# Altium schematic sheet Power_Stage.SchDoc: title
size A3; Author: M.Beldyga; CompanyName: WUT ISE; DrawnBy: M.Beldyga; Organization: WUT ISE; Address1: PW ISE; Address2: Nowowiejska 15/19 00-665 Warsaw; Address3: micbeldyga@gmail.com; SheetNumber: 2; SheetTotal: 3; ModifiedBy: -; CheckedDate: -; Title2: xxx; DivGrp: WUT ISE; Designer: M.Beldyga; ModifiedDate: -; ProjectName: Sensor Box
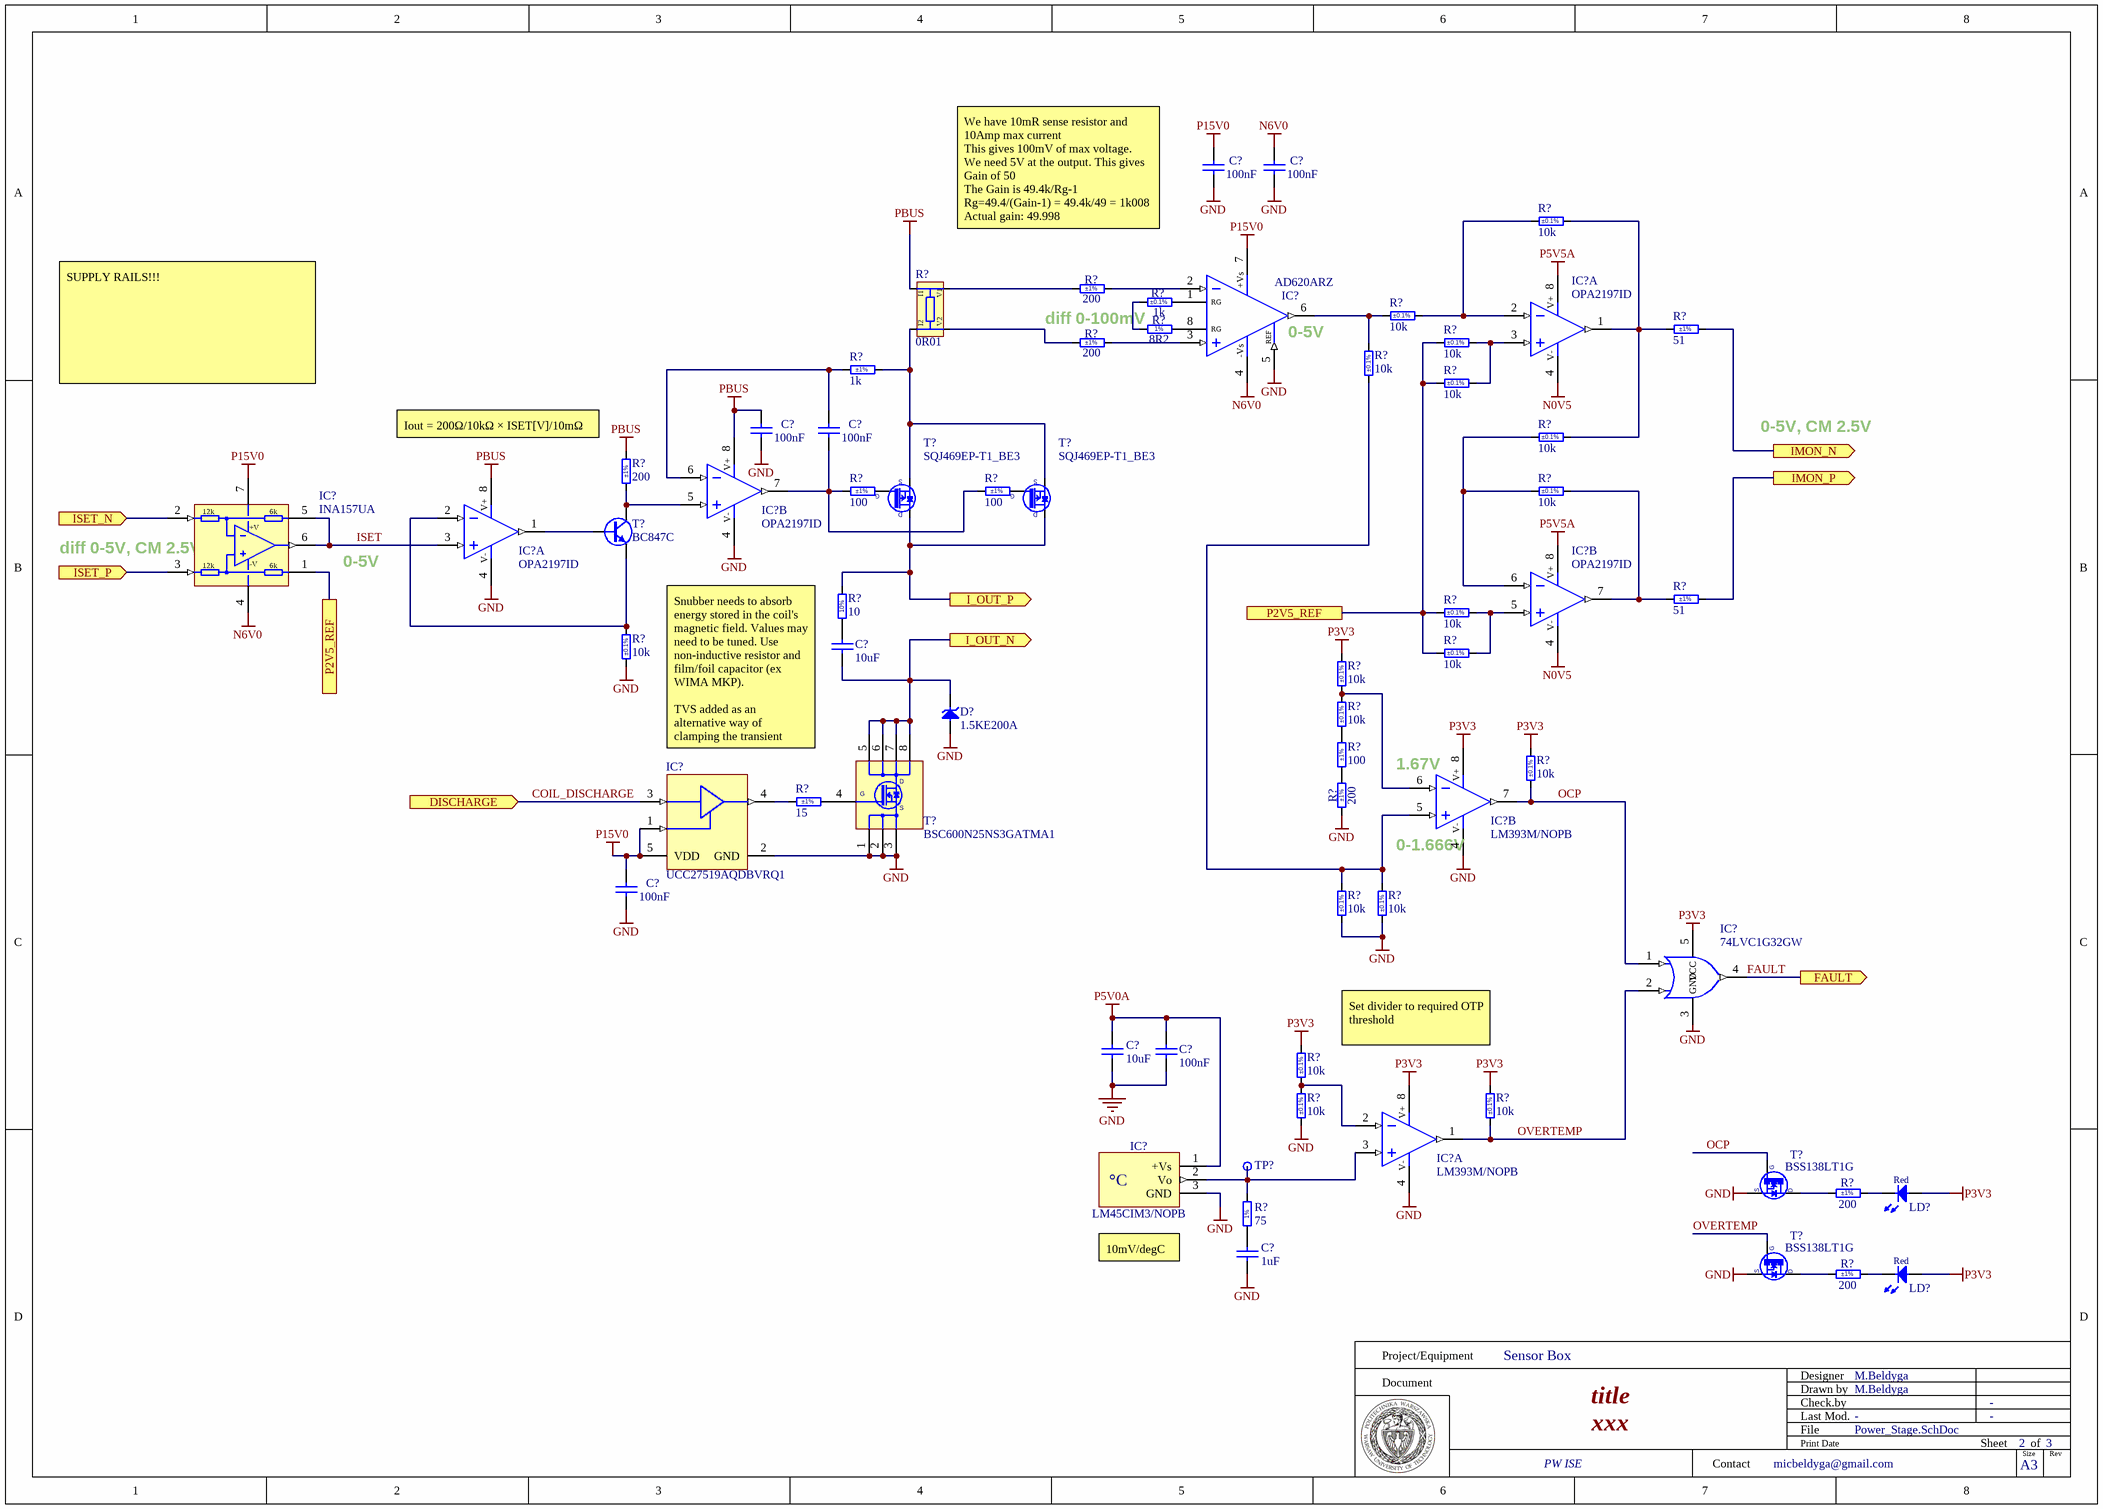
[diagram p0: Power_Stage.SchDoc]

## Parts
(Parts that share a designator on the sheet are numbered #1, #2 ... from top to bottom, then left to right.)
C?#1  100nF  [CAPC1005X55N]
C?#2  100nF  [CAPC1005X55N]
C?#3  100nF  [CAPC1005X55N]
C?#4  100nF  [CAPC1005X55N]
C?#5  10uF  [CAPR3750-2400X4200X1800]
C?#6  100nF  [CAPC1005X55N]
C?#7  10uF  [CAPC1608X80N]
C?#8  100nF  [CAPC1005X55N]
C?#9  1uF  [CAPC1005X55N]
D?  1.5KE200A  [DO-201]
IC?#1  AD620ARZ  [SOIC127P600X175-8N]
IC?#2  OPA2197ID  [SOIC127P600X175-8N]  (part A of 2)
IC?#3  OPA2197ID  [SOIC127P600X175-8N]  (part B of 2)
IC?#4  INA157UA  [SOIC127P600X175-8N]
IC?#5  OPA2197ID  [SOIC127P600X175-8N]  (part A of 2)
IC?#6  OPA2197ID  [SOIC127P600X175-8N]  (part B of 2)
IC?#7  UCC27519AQDBVRQ1  [SOT95P280X145-5N]
IC?#8  LM393M/NOPB  [SOIC127P600X175-8N]  (part B of 2)
IC?#9  74LVC1G32GW  [SOT65P212X110-5N]
IC?#10  LM393M/NOPB  [SOIC127P600X175-8N]  (part A of 2)
IC?#11  LM45CIM3/NOPB  [SOT95P251X112-3N]
LD?#1  Red  [LED_DIALIGHT_555-200]
LD?#2  Red  [LED_DIALIGHT_555-200]
R?#1  10k  Tolerance: ±0.1%  [RESC1005X35N]
R?#2  0R01  [RES_OHMITE_LVK25]
R?#3  200  Tolerance: ±1%  [RESC1608X55N]
R?#4  1k  Tolerance: ±0.1%  [RESC1608X55N]
R?#5  10k  Tolerance: ±0.1%  [RESC1005X35N]
R?#6  8R2  [RESC1608X55N]
R?#7  51  Tolerance: ±1%  [RESC1608X55N]
R?#8  200  Tolerance: ±1%  [RESC1608X55N]
R?#9  10k  Tolerance: ±0.1%  [RESC1005X35N]
R?#10  1k  Tolerance: ±1%  [RESC1005X40N]
R?#11  10k  Tolerance: ±0.1%  [RESC1005X35N]
R?#12  10k  Tolerance: ±0.1%  [RESC1005X35N]
R?#13  10k  Tolerance: ±0.1%  [RESC1005X35N]
R?#14  200  Tolerance: ±1%  [RESC1608X55N]
R?#15  100  Tolerance: ±1%  [RESC1005X40N]
R?#16  100  Tolerance: ±1%  [RESC1005X40N]
R?#17  10k  Tolerance: ±0.1%  [RESC1005X35N]
R?#18  51  Tolerance: ±1%  [RESC1608X55N]
R?#19  10k  Tolerance: ±0.1%  [RESC1005X35N]
R?#20  10k  Tolerance: ±0.1%  [RESC1005X35N]
R?#21  10  [RES_OHMITE_OY]
R?#22  10k  Tolerance: ±0.1%  [RESC1005X35N]
R?#23  10k  Tolerance: ±0.1%  [RESC1005X35N]
R?#24  10k  Tolerance: ±0.1%  [RESC1005X35N]
R?#25  100  Tolerance: ±1%  [RESC1005X40N]
R?#26  10k  Tolerance: ±0.1%  [RESC1005X35N]
R?#27  15  Tolerance: ±1%  [RESC3216X65N]
R?#28  200  Tolerance: ±1%  [RESC1608X55N]
R?#29  10k  Tolerance: ±0.1%  [RESC1005X35N]
R?#30  10k  Tolerance: ±0.1%  [RESC1005X35N]
R?#31  10k  Tolerance: ±0.1%  [RESC1005X35N]
R?#32  10k  Tolerance: ±0.1%  [RESC1005X35N]
R?#33  10k  Tolerance: ±0.1%  [RESC1005X35N]
R?#34  200  Tolerance: ±1%  [RESC1608X55N]
R?#35  75  [RESC1005X40N]
R?#36  200  Tolerance: ±1%  [RESC1608X55N]
T?#1  SQJ469EP-T1_BE3  [PowerPAK® SO-8L SINGLE]
T?#2  SQJ469EP-T1_BE3  [PowerPAK® SO-8L SINGLE]
T?#3  BC847C  [SOT95P240X110-3N]
T?#4  BSC600N25NS3GATMA1  [INFINEON_PG-TDSON-8]
T?#5  BSS138LT1G  [SOT95P240X110-3N]
T?#6  BSS138LT1G  [SOT95P240X110-3N]
TP?  Test Point  [TPS127]  (value not drawn)  (no BOM)

## Ports
DISCHARGE (in), FAULT (out), I_OUT_N (out), I_OUT_P (out), IMON_N (out), IMON_P (out), ISET_N (in), ISET_P (in), P2V5_REF

## Nets
GND: C?#1.1 C?#2.1 C?#3.1 C?#6.1 C?#7.1 C?#8.1 C?#9.1 D?.2(A) IC?#1.5(REF) IC?#3.4(V-) IC?#5.4(V-) IC?#7.2(GND) IC?#8.4(V-) IC?#10.4(V-) IC?#11.3(GND) R?#20.2 R?#28.1 R?#29.1 R?#30.1 R?#32.1 T?#4.1(S) T?#4.2(S) T?#4.3(S) T?#5.2(S) T?#6.2(S)
N0V5: IC?#2.4(V-) IC?#6.4(V-)
N6V0: C?#2.2 IC?#1.4(-Vs) IC?#4.4(-VEE)
P3V3: IC?#8.8(V+) IC?#10.8(V+) LD?#1.2(A) LD?#2.2(A) R?#23.2 R?#26.2 R?#31.2 R?#33.2
P5V0A: C?#7.2 C?#8.2 IC?#11.1(+Vs)
P5V5A: IC?#2.8(V+) IC?#6.8(V+)
P15V0: C?#1.2 C?#6.2 IC?#1.7(+Vs) IC?#4.7(+VCC) IC?#7.1(ENA) IC?#7.5(VDD)
PBUS: C?#3.2 IC?#3.8(V+) IC?#5.8(V+) R?#2.I1 R?#14.2
COIL_DISCHARGE: IC?#7.3(IN+/IN-) ; port DISCHARGE
FAULT: IC?#9.4(Y) ; port FAULT
I_OUT_N: C?#5.1 D?.1(C) T?#4.D ; port I_OUT_N
I_OUT_P: R?#21.2 T?#1.3(D) T?#2.3(D) ; port I_OUT_P
IMON_N: R?#7.2 ; port IMON_N
IMON_P: R?#18.2 ; port IMON_P
ISET: IC?#4.5(SENS) IC?#4.6(OUT) IC?#5.3(IN+)
ISET_N: IC?#4.2(IN-) ; port ISET_N
ISET_P: IC?#4.3(IN+) ; port ISET_P
OCP: IC?#8.7(OUT) IC?#9.1(A) R?#26.1 T?#5.1(G)
OVERTEMP: IC?#9.2(B) IC?#10.1(OUT) R?#33.1 T?#6.1(G)
P2V5_REF: IC?#4.1(REF) R?#9.1 R?#12.1 R?#19.1 R?#22.1 ; port P2V5_REF
NetC?#4_1: C?#4.1 IC?#3.7(OUT) R?#15.1 R?#16.1
NetC?#4_2: C?#4.2 IC?#3.6(IN-) R?#10.1
NetC?#5_2: C?#5.2 R?#21.1
NetC?#9_2: C?#9.2 R?#35.1
NetIC?#1_1: IC?#1.1(-RG) R?#4.2
NetIC?#1_2: IC?#1.2(-IN) R?#3.2
NetIC?#1_3: IC?#1.3(+IN) R?#8.2
NetIC?#1_6: IC?#1.6(Vout) R?#5.1 R?#11.2
NetIC?#1_8: IC?#1.8(+RG) R?#6.2
NetIC?#2_1: IC?#2.1(OUT) R?#1.1 R?#7.1 R?#13.2
NetIC?#2_2: IC?#2.2(IN-) R?#1.2 R?#5.2
NetIC?#2_3: IC?#2.3(IN+) R?#9.2 R?#12.2
NetIC?#3_5: IC?#3.5(IN+) R?#14.1 T?#3.3(C)
NetIC?#5_1: IC?#5.1(OUT) T?#3.1(B)
NetIC?#5_2: IC?#5.2(IN-) R?#20.1 T?#3.2(E)
NetIC?#6_5: IC?#6.5(IN+) R?#19.2 R?#22.2
NetIC?#6_6: IC?#6.6(IN-) R?#13.1 R?#17.2
NetIC?#6_7: IC?#6.7(OUT) R?#17.1 R?#18.1
NetIC?#7_4: IC?#7.4(OUT) R?#27.1
NetIC?#8_5: IC?#8.5(IN+) R?#11.1 R?#29.2 R?#30.2
NetIC?#8_6: IC?#8.6(IN-) R?#23.1 R?#24.2
NetIC?#10_2: IC?#10.2(IN-) R?#31.1 R?#32.2
NetIC?#10_3: IC?#10.3(IN+) IC?#11.2(Vo) R?#35.2 TP?.1
NetLD?#1_1: LD?#1.1(C) R?#34.2
NetLD?#2_1: LD?#2.1(C) R?#36.2
NetR?#2_I2: R?#2.I2 R?#10.2 T?#1.2(S) T?#2.2(S)
NetR?#2_V1: R?#2.V1 R?#3.1
NetR?#2_V2: R?#2.V2 R?#8.1
NetR?#4_1: R?#4.1 R?#6.1
NetR?#15_2: R?#15.2 T?#1.1(G)
NetR?#16_2: R?#16.2 T?#2.1(G)
NetR?#24_1: R?#24.1 R?#25.2
NetR?#25_1: R?#25.1 R?#28.2
NetR?#27_2: R?#27.2 T?#4.4(G)
NetR?#34_1: R?#34.1 T?#5.3(D)
NetR?#36_1: R?#36.1 T?#6.3(D)

Not connected (* = marked no-connect by the designer): IC?#9 3(GND) 5(VCC)

## Notes on the sheet
- We have 10mR sense resistor and 10Amp max current
  This gives 100mV of max voltage.
  We need 5V at the output. This gives Gain of 50
  The Gain is 49.4k/Rg-1
  Rg=49.4/(Gain-1) = 49.4k/49 = 1k008
  Actual gain: 49.998
- SUPPLY RAILS!!!
- (near R?#6) diff 0-100mV
- (near IC?#1) 0-5V
- (near R?#14) Iout = 200Ω/10kΩ × ISET[V]/10mΩ
- 0-5V, CM 2.5V
- (near IC?#4) diff 0-5V, CM 2.5V
- 0-5V
- Snubber needs to absorb energy stored in the coil's magnetic field. Values may need to be tuned. Use non-inductive resistor and film/foil capacitor (ex WIMA MKP).
  TVS added as an alternative way of clamping the transient
- (near IC?#8) 1.67V
- (near IC?#8) 0-1.666V
- (near R?#31) Set divider to required OTP threshold
- (near IC?#11) 10mV/degC
- Labels drawn without touching a wire or pin: GND, P3V3
- Project/Equipment
- Document
- Designer
- Drawn by
- Check.by
- Contact
- File
- Last Mod.
- Print Date
- Sheet
- Size
- A3
- of
- Rev
- (in symbol AD620ARZ) RG
- (in symbol BSC600N25NS3GATMA1) 5; 6; 7
- (in symbol INA157UA) 12k; 6k; +V; -V
- (in symbol LM45CIM3/NOPB) °C
- (in symbol R0402_75R_1%_0.0625W_100PPM) 1%
- (in symbol R0603_8R2_1%_0.1W_200PPM) 1%
- (in symbol RCF_10R_10%_2W_-1300±300PPM_OHMITE_OY) 10%

## Library data of the parts
C?#1-C?#4 C?#6 = CC0402_100NF_16V_10%_X5R: Non-polarised capacitor; Part Description: SMD Multilayer Chip Ceramic Capacitor; Manufacturer: GENERIC; Manufacturer1 Part Number: GRM155R61C104KA88D; Voltage: 16V; TC: X5R; Tolerance: ±10%; Part Number: CC0402_100NF_16V_10%_X5R; Component Kind: Standard; Component Type: Standard; Pin Count: 2; Value: 100nF; Status: None; Manufacturer Part Number: CC0402_100NF_16V_10%_X5R; Case: 0402; Mounted: Yes; Socket: No; SMD: Yes; Sense: No; Manufacturer1 Example: MURATA; Manufacturer1 ComponentHeight: 0.55mm; HelpURL: \\cern.ch\dfs\Applications\Altium\Datasheets\CC0402_X5R_MURATA_GRM.pdf; Author: CERN DEM JLC; CreateDate: 10.12.2013; LatestRevisionDate: 10.12.2013
C?#5 = CPPR_10UF_500V_5%_VISHAY_MKP1848S61050JP2C: Non-polarised capacitor; Part Description: Metallized Polypropylene Film Capacitor (MKP1848S DC-Link); Manufacturer: VISHAY ROEDERSTEIN; Voltage: 500VDC; Tolerance: ±5%; Part Number: CPPR_10UF_500V_5%_VISHAY_MKP1848S61050JP2C; Component Kind: Standard; Component Type: Standard; Pin Count: 2; Value: 10uF; Status: None; Manufacturer Part Number: MKP1848S61050JP2C; Case: LS37.5 W24 x L42 x H18; Mounted: Yes; Socket: No; SMD: No; Sense: No; ComponentHeight: 18mm; HelpURL: \\cern.ch\dfs\Applications\Altium\Datasheets\CPPR_VISHAY_MKP1848S DC-Link.pdf; Author: CERN DEM JLC; CreateDate: 10/23/2013; LatestRevisionDate: 10/23/2013
C?#7 = CC0603_10UF_10V_10%_X5R: Non-polarised capacitor; Part Description: SMD Multilayer Chip Ceramic Capacitor; Manufacturer: GENERIC; Manufacturer1 Part Number: GRM188R61A106KE69D; Voltage: 10V; TC: X5R; Tolerance: ±10%; Part Number: CC0603_10UF_10V_10%_X5R; Component Kind: Standard; Component Type: Standard; Pin Count: 2; Value: 10uF; Status: None; Manufacturer Part Number: CC0603_10UF_10V_10%_X5R; Case: 0603; Mounted: Yes; Socket: No; SMD: Yes; Sense: No; Manufacturer1 Example: MURATA; Manufacturer1 ComponentHeight: 0.8mm; HelpURL: \\cern.ch\dfs\Applications\Altium\Datasheets\CC0603_MURATA_GRM188R61A106KE69D.pdf; Author: CERN DEM JLC; CreateDate: 31.01.2017; LatestRevisionDate: 31.01.2017
C?#8 = CC0402_100NF_50V_10%_X7R: Non-polarised capacitor; Part Description: SMD Multilayer Chip Ceramic Capacitor; Manufacturer: GENERIC; Manufacturer1 Part Number: GRM155R71H104KE14D; Voltage: 50V; TC: X7R; Tolerance: ±10%; Part Number: CC0402_100NF_50V_10%_X7R; Component Kind: Standard; Component Type: Standard; Pin Count: 2; Value: 100nF; Status: None; Manufacturer Part Number: CC0402_100NF_50V_10%_X7R; Case: 0402; Mounted: Yes; Socket: No; SMD: Yes; Sense: No; Manufacturer1 Example: MURATA; Manufacturer1 ComponentHeight: 0.55mm; HelpURL: \\cern.ch\dfs\Applications\Altium\Datasheets\CC0402_MURATA_GRM155R71H104KE14D.pdf; Author: CERN DEM MR; CreateDate: 6/30/2017; LatestRevisionDate: 6/30/2017
C?#9 = CC0402_1UF_16V_10%_X5R: Non-polarised capacitor; Part Description: SMD Multilayer Chip Ceramic Capacitor; Manufacturer: GENERIC; Manufacturer1 Part Number: C1005X5R1C105KT; Voltage: 16V; TC: X5R; Tolerance: ±10%; Part Number: CC0402_1UF_16V_10%_X5R; Component Kind: Standard; Component Type: Standard; Pin Count: 2; Value: 1uF; Status: Preferred; Manufacturer Part Number: CC0402_1UF_16V_10%_X5R; Case: 0402; Mounted: Yes; Socket: No; SMD: Yes; Sense: No; Manufacturer1 Example: TDK; Manufacturer1 ComponentHeight: 0.55mm; HelpURL: \\cern.ch\dfs\Applications\Altium\Datasheets\CC0402_X5R_TDK_C.pdf; Author: CERN DEM JLC; CreateDate: 25.10.2012; LatestRevisionDate: 25.10.2012
D? = 1.5KE200A: Transient Voltage Suppressor Diode (Uni-Directional); Part Description: Uni-directional  Transient Voltage Suppressor Diode - Transil; Manufacturer: LITTELFUSE; Voltage: 200V; Power: 1500W; PressFit: No; Bonding: No; Part Number: 1.5KE200A; Component Kind: Standard; Component Type: Standard; Device: 1.5KE200A; PackageDescription: DO-201, Diode, Axial; Lead Spacing 20.32mm, Lead Dia. 1.07mm, Body Length 9mm, Body Dia. 5.05mm; Manufacturer Part Number: 1.5KE200A; Pin Count: 2; Mounted: Yes; Socket: No; SMD: No; Sense: No; ComponentHeight: 5.3mm; HelpURL: \\cern.ch\dfs\Applications\Altium\Datasheets\1.5KE.pdf; Author: CERN DEM MR; CreateDate: 7/18/2016; LatestRevisionDate: 1/17/2018
IC?#1 = AD620ARZ: Low Cost Low Power Instrumentation Amplifier; Manufacturer1: ANALOG DEVICES; Manufacturer1 Part Number: AD620ARZ-REEL7; PressFit: No; Bonding: No; Part Number: AD620ARZ; Component Kind: Standard; Component Type: Standard; Device: AD620ARZ; PackageDescription: SOIC 8, Pitch 1.27mm - Body 4x5mm, IPC Medium Density; Part Description: Low Cost Low Power Instrumentation Amplifier; Pin Count: 8; Case: SOIC8; Mounted: Yes; Socket: No; SMD: Yes; Sense: No; ComponentHeight: 1.75mm; Author: CERN DEM JLC; HelpURL: \\cern.ch\dfs\Applications\Altium\Datasheets\AD620ARZ.pdf; CreateDate: 13.02.2017; LatestRevisionDate: 29.03.2022
IC?#2 IC?#3 IC?#5 IC?#6 = OPA2197ID: Dual Operational Amplifier; Part Description: Dual, 36-V, Precision, Rail-to-Rail Input/Output, Low Offset Voltage, Operational Amplifiers; Manufacturer: TEXAS INSTRUMENTS; PressFit: No; Bonding: No; Part Number: OPA2197ID; Component Kind: Standard; Component Type: Standard; Device: OPA2197ID; PackageDescription: SOIC 8, Pitch 1.27mm - Body 4x5mm, IPC Medium Density; Manufacturer Part Number: OPA2197ID; Pin Count: 8; Case: SOIC8; Mounted: Yes; Socket: No; SMD: Yes; Sense: No; ComponentHeight: 1.75mm; Author: CERN DEM MR; HelpURL: \\cern.ch\dfs\Applications\Altium\Datasheets\OPA2197ID.pdf; CreateDate: 8/7/2019; LatestRevisionDate: 8/7/2019
IC?#4 = INA157UA: IC OPAMP DIFF 1 CIRCUIT 8SOIC Differential Amplifier 1 Circuit 8-SOIC; Manufacturer: Texas Instruments; Manufacturer Lifecycle Status: ACTIVE; -3db Bandwidth: 4MHz; Common Mode Rejection Ratio: 80dB; Dual Supply Voltage: 15V; Gain Bandwidth Product: 3MHz; Input Offset Voltage (Vos): 100µV; Max Dual Supply Voltage: 18V; Min Dual Supply Voltage: 4V; Min Supply Voltage: 8V; Nominal Supply Current: 2.4mA; Number of Amplifiers: 1; Number of Channels: 2; Output Current per Channel: 60mA; Value: 24kΩ; Settling Time: 2ns; Slew Rate: 14V/µs; Voltage Gain: 6.02dB; Supplier: DigiKey; Supplier Part Number: INA157UA-ND; Manufacturer Part Number: INA157UA; RoHS: Compliant; Category: Amplifiers - Op Amps, Buffer, Instrumentation; Stock: 608; Pricing: 1=3.99, 10=3.019, 75=2.55467, 150=2.44673, 300=2.35783, 525=2.2977, 1050=2.23519, 2550=2.17103 (USD); Case/Package: SOIC; Height: 1.75mm; Lead Free: Lead Free; Length: 4.9mm; Lifecycle Status: Production; Max Supply Voltage: 18V; Max Operating Temperature: 85°C; Min Input Voltage: 4V; Min Operating Temperature: -40°C; Number of Circuits: 1; Number of Elements: 1; Pins: 8; Operating Supply Current: 2.4mA; Quiescent Current: 2.4mA; Radiation Hardening: No; REACH SVHC: No; Thickness: 1.58mm; Weight: 75.891673mg; Width: 3.91mm; ComponentLink1URL: https://sigma.octopart.com:443/49249642/technical_drawing/Texas-Instruments-INA157UA.pdf?src-supplier=Texas+Instruments; ComponentLink1Description: https://sigma.octopart.com:443/49249642/technical_drawing/Texas-Instruments-INA157UA.pdf?src-supplier=Texas+Instruments; ComponentLink2URL: https://octopart.com:443/opatz8j6/c1?t=U1EGlDNQZqLQs-EwIsscqEEx-AfnVOllSlN4p0sh4PLdG1CcVMKRtmhTNlN5f_Uh_vUGKP152rEL5GLEXC8DNZuiG5tbL9tPH-teoooIFRknLMdlw0_Jv4zBSHnT4PvLcvwFqHgDMUmN8-CU-c3UHujaNllWAgd-PDXByNTyJSuUkuVnwLSvEPkd0Q_esnRAQitWnREmUgqmclHl2b6W6tCFcyWDuRzDd4IkS-8MZ59sgpEPanuaKX1qGjiQLPbd3OG0klFAyskjpNKaHTZEnEYEGL77h_GEymF0r_g3ACZDzpib4ELj8IvhiwXeMcRieELbSgYPCbUTcjZO1RvHbL2-kGPWqPzznfkJGrgq9ClaUaTRrtnm5Mq_6ye76DY4o9A&src-supplier=Texas+Instruments; ComponentLink2Description: https://octopart.com:443/opatz8j6/c1?t=U1EGlDNQZqLQs-EwIsscqEEx-AfnVOllSlN4p0sh4PLdG1CcVMKRtmhTNlN5f_Uh_vUGKP152rEL5GLEXC8DNZuiG5tbL9tPH-teoooIFRknLMdlw0_Jv4zBSHnT4PvLcvwFqHgDMUmN8-CU-c3UHujaNllWAgd-PDXByNTyJSuUkuVnwLSvEPkd0Q_esnRAQitWnREmUgqmclHl2b6W6tCFcyWDuRzDd4IkS-8MZ59sgpEPanuaKX1qGjiQLPbd3OG0klFAyskjpNKaHTZEnEYEGL77h_GEymF0r_g3ACZDzpib4ELj8IvhiwXeMcRieELbSgYPCbUTcjZO1RvHbL2-kGPWqPzznfkJGrgq9ClaUaTRrtnm5Mq_6ye76DY4o9A&src-supplier=Texas+Instruments; ComponentLink3URL: https://datasheet.octopart.com:443/INA157UA-Texas-Instruments-datasheet-152917.pdf?src-supplier=Texas+Instruments; ComponentLink3Description: https://datasheet.octopart.com:443/INA157UA-Texas-Instruments-datasheet-152917.pdf?src-supplier=Texas+Instruments; ComponentLink4URL: https://datasheet.octopart.com:443/INA157UA-Texas-Instruments-datasheet-10257352.pdf?src-supplier=element14+APAC; ComponentLink4Description: https://datasheet.octopart.com:443/INA157UA-Texas-Instruments-datasheet-10257352.pdf?src-supplier=element14+APAC; ComponentLink5URL: https://datasheet.octopart.com:443/INA157UA-Texas-Instruments-datasheet-30905.pdf?src-supplier=DigiKey; ComponentLink5Description: https://datasheet.octopart.com:443/INA157UA-Texas-Instruments-datasheet-30905.pdf?src-supplier=DigiKey; ComponentLink6URL: https://datasheet.octopart.com:443/INA157UA-Texas-Instruments-datasheet-14140569.pdf?src-supplier=iiiC; ComponentLink6Description: https://datasheet.octopart.com:443/INA157UA-Texas-Instruments-datasheet-14140569.pdf?src-supplier=iiiC; ComponentLink7URL: https://datasheet.octopart.com:443/INA157UA-Texas-Instruments-datasheet-8443426.pdf?src-supplier=Jameco; ComponentLink7Description: https://datasheet.octopart.com:443/INA157UA-Texas-Instruments-datasheet-8443426.pdf?src-supplier=Jameco; ComponentLink8URL: http://sigma.octopart.com:80/reach_statement/Texas-Instruments-company-64.pdf?src-supplier=Compliance+Statements; ComponentLink8Description: http://sigma.octopart.com:80/reach_statement/Texas-Instruments-company-64.pdf?src-supplier=Compliance+Statements; ComponentLink9URL: http://sigma.octopart.com:80/conflict_mineral_statement/Texas-Instruments-company-63.pdf?src-supplier=Compliance+Statements; ComponentLink9Description: http://sigma.octopart.com:80/conflict_mineral_statement/Texas-Instruments-company-63.pdf?src-supplier=Compliance+Statements
IC?#7 = UCC27519AQDBVRQ1: Single-Channel High-Speed Low-Side Gate Driver With Negative Input  Voltage Capability; Manufacturer: TEXAS INSTRUMENTS; PressFit: No; Bonding: No; Part Number: UCC27519AQDBVRQ1; Component Kind: Standard; Component Type: Standard; Device: UCC27519AQDBVRQ1; PackageDescription: SOT, 0.95mm Pitch; 5 pin, 1.60mm W X 2.90mm L X 1.45mm H body, IPC Medium Density; Part Description: Single-Channel High-Speed Low-Side Gate Driver with Negative Input  Voltage Capability; Manufacturer Part Number: UCC27519AQDBV; Pin Count: 5; Case: SOT23-5; Mounted: Yes; Socket: No; SMD: Yes; Sense: No; ComponentHeight: 1.45mm; Author: CERN DEM JLC; HelpURL: \\cern.ch\dfs\Applications\Altium\Datasheets\UCC27519AQDBVRQ1.pdf; CreateDate: 7/16/2018; LatestRevisionDate: 6/13/2022
IC?#8 IC?#10 = LM393M/NOPB: Dual Operational Amplifier; Part Description: Low Power Low Offset Voltage Dual Comparators; Manufacturer: NATIONAL SEMICONDUCTOR; Manufacturer Part Number: LM393M; PressFit: No; Bonding: No; Part Number: LM393M/NOPB; Component Kind: Standard; Component Type: Standard; Device: LM393M/NOPB; PackageDescription: SOIC 8, Pitch 1.27mm - Body 4x5mm, IPC Medium Density; Pin Count: 8; Case: SOIC8; Mounted: Yes; Socket: No; SMD: Yes; Sense: No; ComponentHeight: 1.75mm; Author: CERN DEM JLC; HelpURL: \\cern.ch\dfs\Applications\Altium\Datasheets\LM393M-NOPB.pdf; CreateDate: 11/18/2011; LatestRevisionDate: 6/2/2022
IC?#9 = 74LVC1G32GW: Single 2-Input Positive-OR Gate; Part Description: Single 2-input OR gate; Manufacturer: NXP SEMICONDUCTORS; PressFit: No; Bonding: No; Part Number: 74LVC1G32GW; Component Kind: Standard; Component Type: Standard; Device: 74LVC1G32GW; PackageDescription: SOT353, SC70-5, 0.65mm Pitch; 5 Pin, 1.25mm W X 2.05mm L X 1.10mm H body, IPC Medium Density; Manufacturer Part Number: 74LVC1G32GW; Pin Count: 5; Case: SOT353; Mounted: Yes; Socket: No; SMD: Yes; Sense: No; ComponentHeight: 1.1mm; Author: CERN DEM JLC; HelpURL: \\cern.ch\dfs\Applications\Altium\Datasheets\74LVC1G32GW.pdf; CreateDate: 11/25/2013; LatestRevisionDate: 11/25/2013
IC?#11 = LM45CIM3/NOPB: -20° to +100°C ±3°C Precision Centigrade Temperature Sensors; Manufacturer: TEXAS INSTRUMENTS; PressFit: No; Bonding: No; Part Number: LM45CIM3/NOPB; Component Kind: Standard; Component Type: Standard; Device: LM45CIM3/NOPB; PackageDescription: SOT, 0.95mm Pitch; 3 Pin, 1.30mm W X 2.92mm L X 1.12mm H body, IPC Medium Density; Part Description: -20° to +100°C ±3°C Precision Centigrade Temperature Sensors; Manufacturer Part Number: LM45CIM3/NOPB; Pin Count: 3; Case: SOT23; Mounted: Yes; Socket: No; SMD: Yes; Sense: No; ComponentHeight: 1.12mm; HelpURL: \\cern.ch\dfs\Applications\Altium\Datasheets\LM45CIM3-NOPB.pdf; Author: CERN DEM JLC; CreateDate: 19/01/2011; LatestRevisionDate: 19/01/2011
LD?#1 LD?#2 = LED_DIALIGHT_555-2001F: LED Red 1C 2A; Part Description: Single 2mm Red LED CBI® Circuit Board Indicator; PressFit: No; Bonding: No; Part Number: LED_DIALIGHT_555-2001F; Component Kind: Standard; Component Type: Standard; Color: Red; PackageDescription: Single 2mm Red LED, Body 5.08x2.54mm, Pin spacing 2.54mm; Manufacturer1: DIALIGHT; Manufacturer1 Part Number: 555-2001F; Pin Count: 2; Mounted: Yes; Socket: No; SMD: No; Sense: No; ComponentHeight: 6.35mm; HelpURL: \\cern.ch\dfs\Applications\Altium\Datasheets\LED_DIALIGHT_555-2001F.pdf; Author: CERN DEM JMW; CreateDate: 22.09.2008; LatestRevisionDate: 17.03.2010
R?#1 R?#5 R?#9 R?#11-R?#13 R?#17 R?#19 R?#20 R?#22-R?#24 R?#26 R?#29-R?#33 = R0402_10K_0.1%_0.063W_25PPM: Resistor - 0.1%; Part Description: Thin Film Precision Resistor; Manufacturer: GENERIC; Manufacturer1 Part Number: CPF0402B10KE1; Power: 0.063W; TC: ±25ppm/°C; PressFit: No; Part Number: R0402_10K_0.1%_0.063W_25PPM; Component Kind: Standard; Component Type: Standard; Pin Count: 2; Value: 10k; Status: Not Recommended; Manufacturer Part Number: R0402_10K_0.1%_0.063W_25PPM; Case: 0402; Mounted: Yes; Sense: No; Socket: No; SMD: Yes; Manufacturer1 Example: TE CONNECTIVITY; Manufacturer1 ComponentHeight: 0.35mm; HelpURL: \\cern.ch\dfs\Applications\Altium\Datasheets\R0402_TYCO_CPF.pdf; Author: CERN DEM JMW; CreateDate: 9/22/2015; LatestRevisionDate: 9/22/2015
R?#2 = R_0R01_1%_2W_100PPM_OHMITE_LVK25: Power and Current Sensing Resistor; Part Description: Four Terminal High Precision Current Sense; Manufacturer: OHMITE; Manufacturer Part Number: LVK25R010FER; Power: 2W; TC: ±100ppm/°C; Tolerance: ±1%; PressFit: No; Part Number: R_0R01_1%_2W_100PPM_OHMITE_LVK25; Component Kind: Standard; Component Type: Standard; Pin Count: 4; Value: 0R01; Status: None; Mounted: Yes; Sense: No; Socket: No; SMD: Yes; ComponentHeight: 0.7mm; HelpURL: \\cern.ch\dfs\Applications\Altium\Datasheets\R_OHMITE_LVK25.pdf; Author: CERN DEM BC; CreateDate: 9/7/2020; LatestRevisionDate: 9/7/2020
R?#3 R?#8 R?#28 R?#34 R?#36 = R0603_200R_1%_0.1W_100PPM: Resistor - 1%; Part Description: General Purpose Thick Film Chip Resistor; Manufacturer: GENERIC; Manufacturer1: Vishay; Manufacturer1 Part Number: CRCW0603200RFKEA; Power: 0.1W; TC: ±100ppm/°C; PressFit: No; Part Number: R0603_200R_1%_0.1W_100PPM; Component Kind: Standard; Component Type: Standard; Pin Count: 2; Value: 200; Status: Preferred; Manufacturer Part Number: R0603_200R_1%_0.1W_100PPM; Case: 0603; Mounted: Yes; Sense: No; Socket: No; SMD: Yes; Manufacturer1 ComponentHeight: 0.55mm; HelpURL: \\cern.ch\dfs\Applications\Altium\Datasheets\R0603_NIC_NRC.pdf; Author: CERN DEM JLC; CreateDate: 03.12.2007; LatestRevisionDate: 13.03.2008
R?#4 = R0603_1K_0.1%_0.063W_10PPM: Resistor - 0.1%; Part Description: Thin Film Chip Resistor; Manufacturer: GENERIC; Manufacturer1: TYCO HOLSWORTHY; Manufacturer1 Part Number: RN73C1J1K0BTG; Power: 0.063W; TC: ±10ppm; PressFit: No; Part Number: R0603_1K_0.1%_0.063W_10PPM; Component Kind: Standard; Component Type: Standard; Pin Count: 2; Value: 1k; Status: Not Recommended; Manufacturer Part Number: R0603_1K_0.1%_0.063W_10PPM; Case: 0603; Mounted: Yes; Sense: No; Socket: No; SMD: Yes; Manufacturer1 ComponentHeight: 0.55mm; HelpURL: \\cern.ch\dfs\Applications\Altium\Datasheets\R0603_Tyco_RN73.pdf; Author: CERN DEM BC; CreateDate: 23.05.2016; LatestRevisionDate: 23.05.2016
R?#6 = R0603_8R2_1%_0.1W_200PPM: Resistor - 1%; Part Description: General Purpose Thick Film Chip Resistor; Manufacturer: GENERIC; Manufacturer1: YAGEO PHYCOMP; Manufacturer1 Part Number: RC0603FR-078R2L; Power: 0.1W; TC: ±200ppm/°C; PressFit: No; Part Number: R0603_8R2_1%_0.1W_200PPM; Component Kind: Standard; Component Type: Standard; Pin Count: 2; Value: 8R2; Status: Preferred; Tolerance: ±1%; Manufacturer Part Number: R0603_8R2_1%_0.1W_200PPM; Case: 0603; Mounted: Yes; Sense: No; Socket: No; SMD: Yes; Manufacturer1 ComponentHeight: 0.65mm; HelpURL: \\cern.ch\dfs\Applications\Altium\Datasheets\R0603_Phycomp_RC0603.pdf; Author: CERN DEM JLC; CreateDate: 03/12/2007; LatestRevisionDate: 17/10/2012
R?#7 R?#18 = R0603_51R_1%_0.1W_100PPM: Resistor - 1%; Part Description: General Purpose Thick Film Chip Resistor; Manufacturer: GENERIC; Manufacturer1 Part Number: NRC06F51R0TRF; Power: 0.1W; TC: ±100ppm/°C; PressFit: No; Part Number: R0603_51R_1%_0.1W_100PPM; Component Kind: Standard; Component Type: Standard; Pin Count: 2; Value: 51; Status: Preferred; Manufacturer Part Number: R0603_51R_1%_0.1W_100PPM; Case: 0603; Mounted: Yes; Sense: No; Socket: No; SMD: Yes; Manufacturer1 Example: NIC COMPONENT; Manufacturer1 ComponentHeight: 0.55mm; HelpURL: \\cern.ch\dfs\Applications\Altium\Datasheets\R0603_NIC_NRC.pdf; Author: CERN DEM JLC; CreateDate: 12/3/2007; LatestRevisionDate: 3/13/2008
R?#10 = R0402_1K_1%_0.0625W_100PPM: Resistor - 1%; Part Description: General Purpose Thick Film Chip Resistor; Manufacturer: GENERIC; Manufacturer1 Part Number: 232270671002L; TC: ±100ppm/°C; PressFit: No; Part Number: R0402_1K_1%_0.0625W_100PPM; Component Kind: Standard; Component Type: Standard; Pin Count: 2; Value: 1k; Status: Not Recommended; Power: 0.0625W; Manufacturer Part Number: R0402_1K_1%_0.0625W_100PPM; Case: 0402; Mounted: Yes; Sense: No; Socket: No; SMD: Yes; Manufacturer1 Example: YAGEO PHYCOMP; Manufacturer1 ComponentHeight: 0.4mm; HelpURL: \\cern.ch\dfs\Applications\Altium\Datasheets\R0402_Phycomp_RC0402.pdf; Author: CERN DEM JLC; CreateDate: 12/3/2007; LatestRevisionDate: 10/17/2012
R?#14 = R0603_200R_1%_0.1W_100PPM: Resistor - 1%; Part Description: General Purpose Thick Film Chip Resistor; Manufacturer: GENERIC; Manufacturer1 Part Number: NRC06F2000TRF; Power: 0.1W; TC: ±100ppm/°C; PressFit: No; Part Number: R0603_200R_1%_0.1W_100PPM; Component Kind: Standard; Component Type: Standard; Pin Count: 2; Value: 200; Status: Preferred; Manufacturer Part Number: R0603_200R_1%_0.1W_100PPM; Case: 0603; Mounted: Yes; Sense: No; Socket: No; SMD: Yes; Manufacturer1 Example: NIC COMPONENT; Manufacturer1 ComponentHeight: 0.55mm; HelpURL: \\cern.ch\dfs\Applications\Altium\Datasheets\R0603_NIC_NRC.pdf; Author: CERN DEM JLC; CreateDate: 12/3/2007; LatestRevisionDate: 3/13/2008
R?#15 R?#16 R?#25 = R0402_100R_1%_0.0625W_100PPM: Resistor - 1%; Part Description: General Purpose Thick Film Chip Resistor; Manufacturer: GENERIC; Manufacturer1 Part Number: 232270671001L; TC: ±100ppm/°C; PressFit: No; Part Number: R0402_100R_1%_0.0625W_100PPM; Component Kind: Standard; Component Type: Standard; Pin Count: 2; Value: 100; Status: Not Recommended; Power: 0.0625W; Manufacturer Part Number: R0402_100R_1%_0.0625W_100PPM; Case: 0402; Mounted: Yes; Sense: No; Socket: No; SMD: Yes; Manufacturer1 Example: YAGEO PHYCOMP; Manufacturer1 ComponentHeight: 0.4mm; HelpURL: \\cern.ch\dfs\Applications\Altium\Datasheets\R0402_Phycomp_RC0402.pdf; Author: CERN DEM JLC; CreateDate: 12/3/2007; LatestRevisionDate: 10/17/2012
R?#21 = RCF_10R_10%_2W_-1300±300PPM_OHMITE_OY: Resistor - 10%; Part Description: Ceramic Composition Resistor - OY Series; Manufacturer: OHMITE; Manufacturer Part Number: OY100KE; Power: 2W; TC: -1300±300ppm/°C; PressFit: No; Part Number: RCF_10R_10%_2W_-1300±300PPM_OHMITE_OY; Component Kind: Standard; Component Type: Standard; Pin Count: 2; Value: 10; Status: Not recommended; Tolerance: ±10%; Case: LS30 L22.5 x D8; Mounted: Yes; Sense: No; Socket: No; SMD: No; ComponentHeight: 8mm; HelpURL: \\cern.ch\dfs\Applications\Altium\Datasheets\RCF_OHMITE_OY.pdf; Author: CERN DEM MR; CreateDate: 5/13/2016; LatestRevisionDate: 5/13/2016
R?#27 = R1206_15R_1%_0.25W_100PPM: Resistor - 1%; Part Description: General Purpose Thick Film Chip Resistor; Manufacturer: GENERIC; Manufacturer1 Part Number: NRC12F15R0TRF; Power: 0.25W; TC: ±100ppm/°C; PressFit: No; Part Number: R1206_15R_1%_0.25W_100PPM; Component Kind: Standard; Component Type: Standard; Pin Count: 2; Value: 15; Status: Preferred; Manufacturer Part Number: R1206_15R_1%_0.25W_100PPM; Case: 1206; Mounted: Yes; Sense: No; Socket: No; SMD: Yes; Manufacturer1 Example: NIC COMPONENT; Manufacturer1 ComponentHeight: 0.65mm; HelpURL: \\cern.ch\dfs\Applications\Altium\Datasheets\R1206_NIC_NRC.pdf; Author: CERN DEM JLC; CreateDate: 12/3/2007; LatestRevisionDate: 3/13/2008
R?#35 = R0402_75R_1%_0.0625W_100PPM: Resistor - 1%; Part Description: General Purpose Thick Film Chip Resistor; Manufacturer: GENERIC; Manufacturer1 Part Number: 232270677509L; TC: ±100ppm/°C; PressFit: No; Part Number: R0402_75R_1%_0.0625W_100PPM; Component Kind: Standard; Component Type: Standard; Pin Count: 2; Value: 75; Status: Not Recommended; Power: 0.0625W; Tolerance: ±1%; Manufacturer Part Number: R0402_75R_1%_0.0625W_100PPM; Case: 0402; Mounted: Yes; Sense: No; Socket: No; SMD: Yes; Manufacturer1 Example: YAGEO PHYCOMP; Manufacturer1 ComponentHeight: 0.4mm; HelpURL: \\cern.ch\dfs\Applications\Altium\Datasheets\R0402_Phycomp_RC0402.pdf; Author: CERN DEM JLC; CreateDate: 03/12/2007; LatestRevisionDate: 17/10/2012
T?#3 = BC847C: NPN Transistor; Part Description: 45V 100mA NPN Silicon AF Transistor; Manufacturer: INFINEON; PressFit: No; Bonding: No; Part Number: BC847C; Component Kind: Standard; Component Type: Standard; Device: BC847C; PackageDescription: SOT23, 0.95mm Pitch; 3 Pin, 1.40mm W X 3.00mm L X 1.10mm H body, IPC Medium Density; Manufacturer Part Number: BC847C; Pin Count: 3; Case: SOT23-3; Mounted: Yes; Socket: No; SMD: Yes; Sense: No; ComponentHeight: 1.1mm; HelpURL: \\cern.ch\dfs\Applications\Altium\Datasheets\BC847C.pdf; Author: CERN DEM JLC; CreateDate: 9/23/2014; LatestRevisionDate: 9/23/2014
T?#4 = BSC600N25NS3GATMA1: MOSFET Transistor, N Channel, 25 A, 250 V, 0.05 ohm, 10 V, 3 V; Manufacturer: Infineon; Continuous Drain Current (ID): 25A; Drain to Source Resistance: 60mΩ; Drain to Source Voltage (Vdss): 250V; Gate to Source Voltage (Vgs): 20V; Input Capacitance: 1.77nF; Max Power Dissipation: 125W; Number of Elements: 1; Rise Time: 10ns; Supplier: DigiKey; Supplier Part Number: BSC600N25NS3GATMA1CT-ND; Manufacturer Part Number: BSC600N25NS3GATMA1; RoHS: Compliant; Category: MOSFETs; Stock: 12980; Pricing: 1=4.08, 10=2.681, 100=1.8868, 500=1.70212, 5000=1.39062 (USD); China RoHS: Non-Compliant; Contact Plating: Tin; Country of Origin: Malaysia; Export Control Classification Number (ECCN) Code: EAR99; Halogen Free: Halogen Free; Introduction Date: 2009-10-23; Lead Free: Contains Lead; Lifecycle Status: Production; Max Dual Supply Voltage: 250V; Max Operating Temperature: 150°C; Min Breakdown Voltage: 250V; Min Operating Temperature: -55°C; Mounting Technology: Surface Mount; Pins: 8; Number of Terminals: 8; On-State Resistance: 60mΩ; Package Quantity: 5000; Packaging: Tape & Reel; Power Dissipation: 125W; REACH SVHC: No; Schedule B: 8541290080, 8541290080|8541290080|8541290080|8541290080|8541290080; ComponentLink1URL: https://datasheet.octopart.com:443/BSC600N25NS3GATMA1-Infineon-datasheet-13720809.pdf?src-supplier=Newark; ComponentLink1Description: https://datasheet.octopart.com:443/BSC600N25NS3GATMA1-Infineon-datasheet-13720809.pdf?src-supplier=Newark; ComponentLink2URL: https://datasheet.octopart.com:443/BSC600N25NS3-G-Infineon-datasheet-11795221.pdf?src-supplier=Farnell; ComponentLink2Description: https://datasheet.octopart.com:443/BSC600N25NS3-G-Infineon-datasheet-11795221.pdf?src-supplier=Farnell; ComponentLink3URL: http://sigma.octopart.com:80/conflict_mineral_statement/Infineon-company-51.pdf?src-supplier=Compliance+Statements; ComponentLink3Description: http://sigma.octopart.com:80/conflict_mineral_statement/Infineon-company-51.pdf?src-supplier=Compliance+Statements
T?#5 T?#6 = BSS138LT1G: N-CHANNEL MOSFET WITH DIODE; Part Description: 50V 200mA N-Channel Enhancement Mode Field-Effect Transistor; Manufacturer1: ON SEMICONDUCTOR; PressFit: No; Bonding: No; Part Number: BSS138LT1G; Component Kind: Standard; Component Type: Standard; Device: BSS138LT1G; PackageDescription: SOT23 3-Leads, Pitch 0.95mm - Body 1.4x3mm, IPC Medium Density; Manufacturer1 Part Number: BSS138LT1G; Pin Count: 3; Case: SOT23-3; Mounted: Yes; Socket: No; SMD: Yes; Sense: No; ComponentHeight: 1.11mm; HelpURL: \\cern.ch\dfs\Applications\Altium\Datasheets\BSS138LT1G.pdf; Author: CERN DEM JLC; CreateDate: 23.03.2009; LatestRevisionDate: 23.03.2009
TP? = SMD_PAD_1.27X1.27MM: Part Description: 1.27mm x 1.27mm PCB Copper Area (SMD Test Point); Mounted: No; Part Number: SMD_PAD_1.27X1.27MM; Component Type: Standard (No BOM); Pin Count: 1; Family: Test Point; Socket: No; SMD: Yes; Sense: No; Status: None; ComponentHeight: 0mm; HelpURL: Undefined; Author: CERN DEM JLC; CreateDate: 12.01.2008; LatestRevisionDate: 12.01.2008; PackageDescription: 1.27mm x 1.27mm PCB Copper Area (SMD Test Point)